# Altium project Almazny.PrjPCB (part 1 of 2)
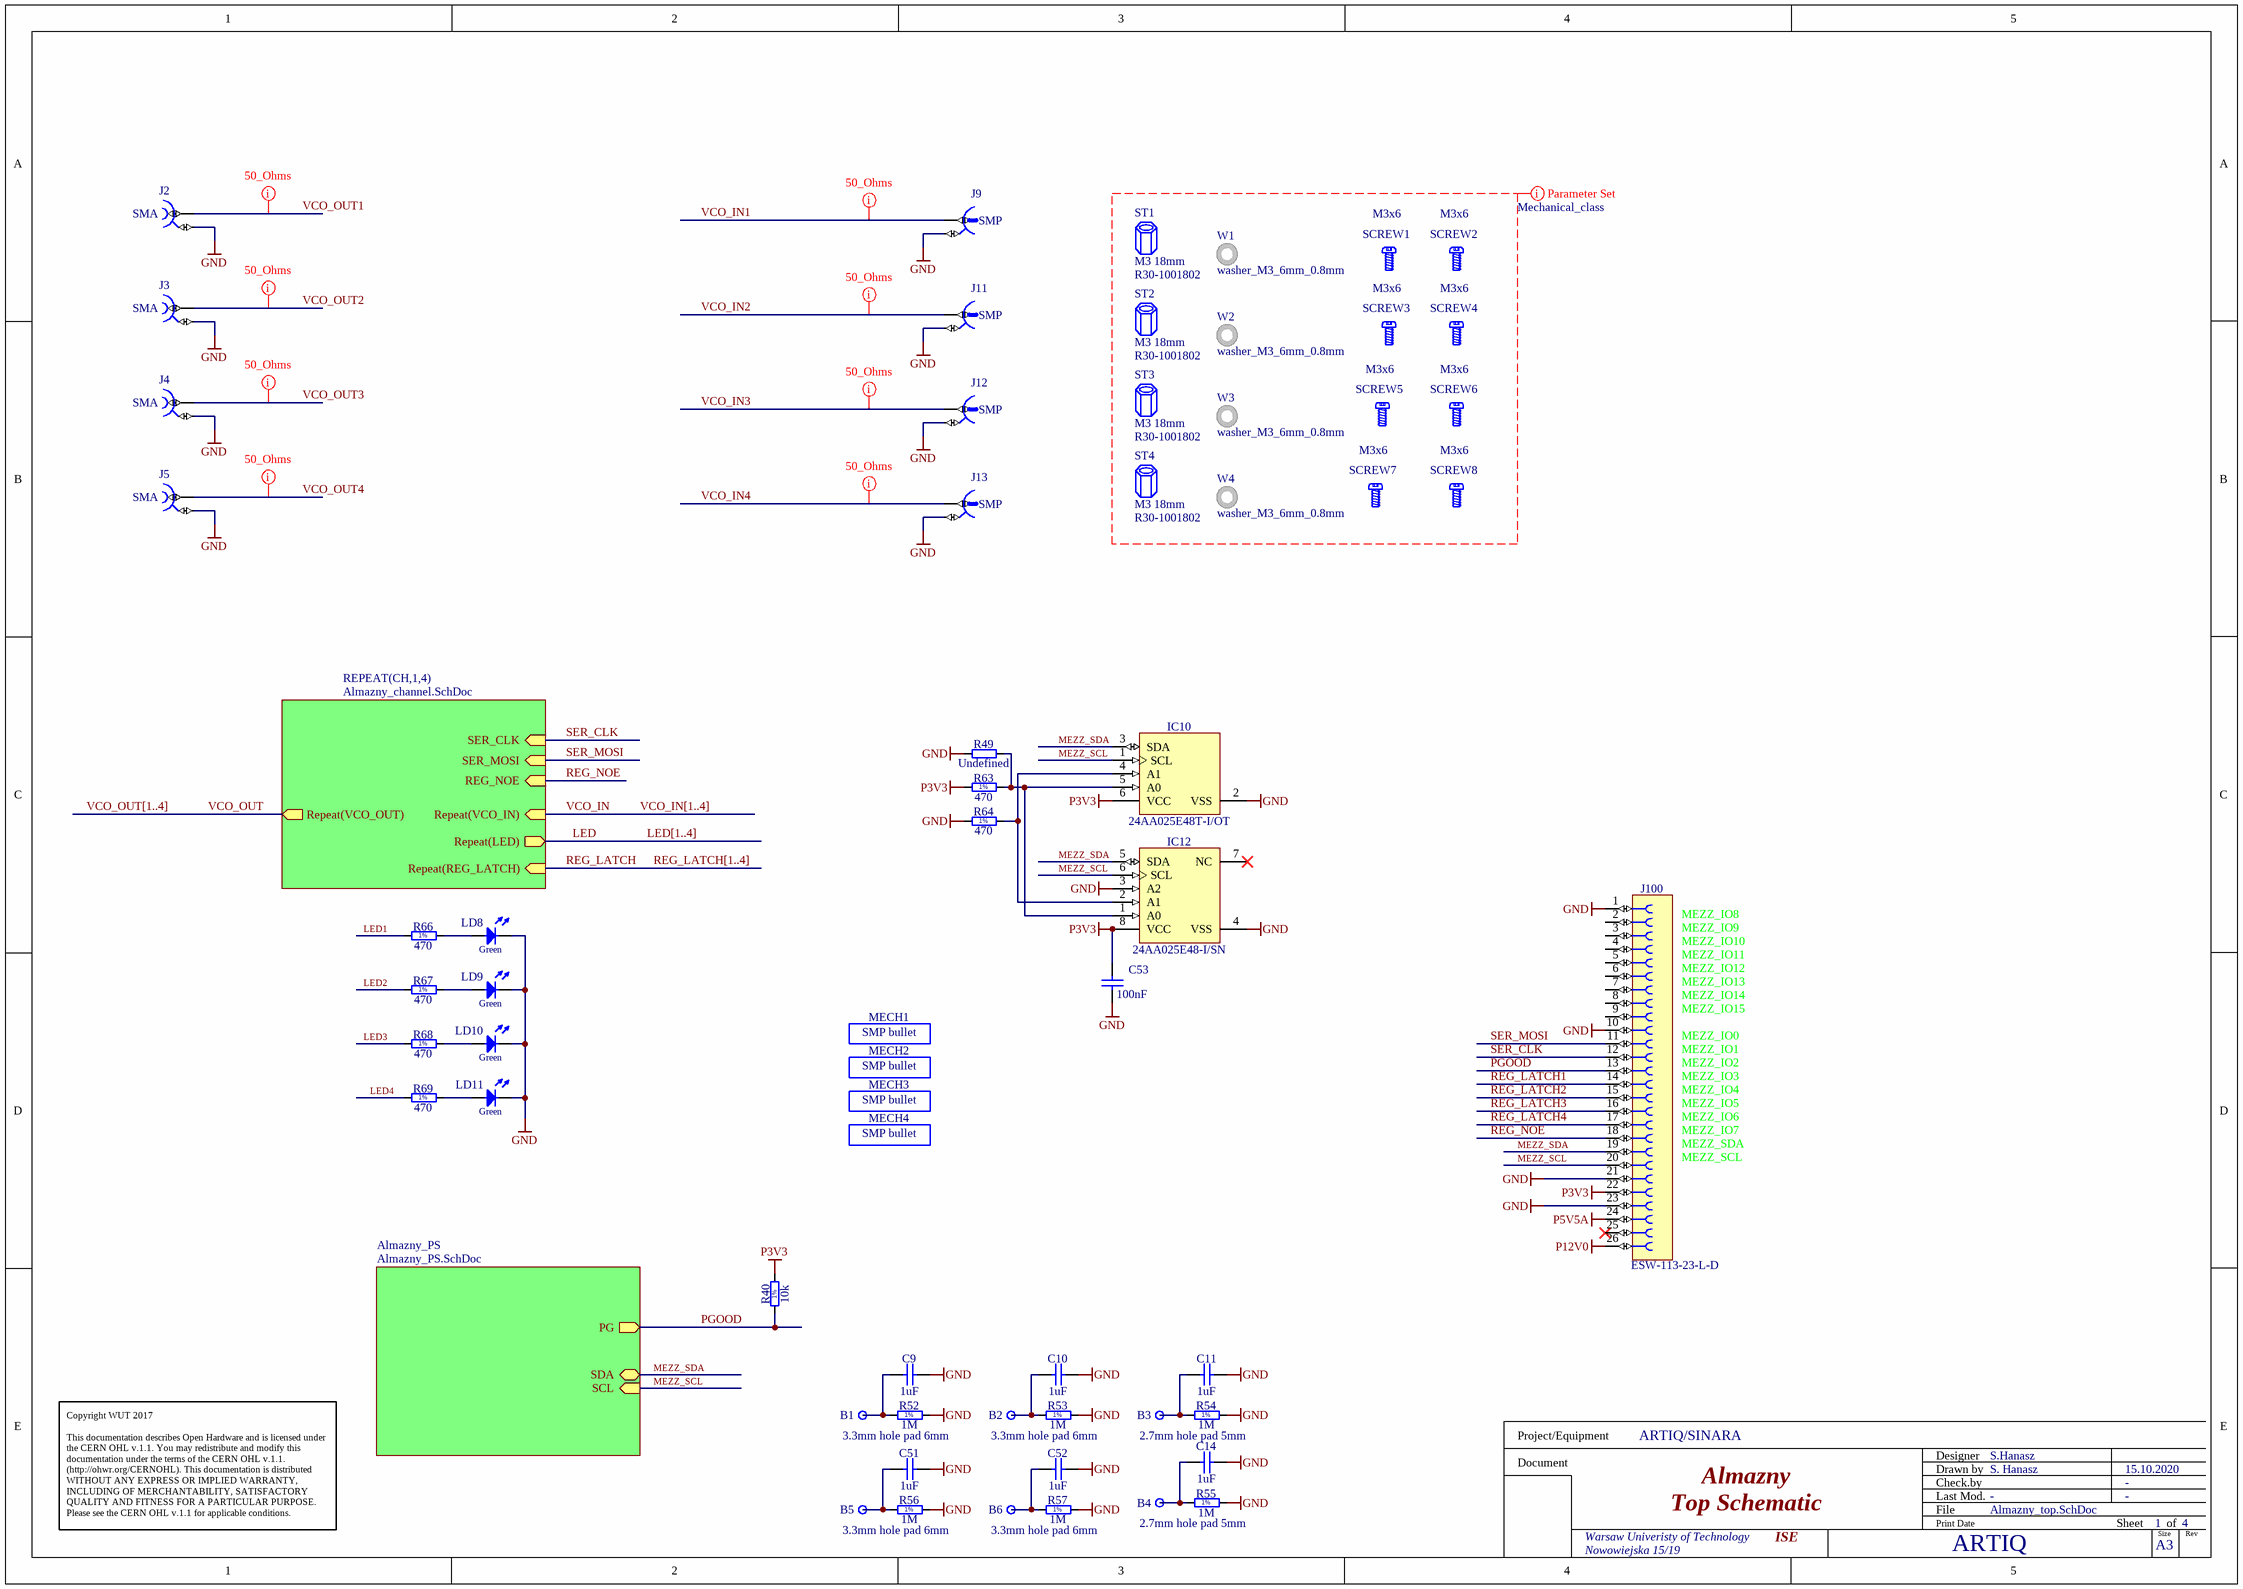
[diagram p0: Almazny_top.SchDoc]
P_version: 1.3.1
4 sheets, 429 parts. Net scope: hierarchical (ports join the sheet entries above them; power ports are global).
Board file: Almazny.PcbDoc
Sheets:
  Almazny_top.SchDoc
    CH1 = Almazny_channel.SchDoc
    CH2 = Almazny_channel.SchDoc
    CH3 = Almazny_channel.SchDoc
    CH4 = Almazny_channel.SchDoc
    Almazny_PS = Almazny_PS.SchDoc
      LT3094_N2V25 = LT3094.SchDoc
      LT3094_N5V0 = LT3094.SchDoc

## Sheet Almazny_top.SchDoc: Almazny
size 420 x 297 mm; Author: many authors; CompanyName: WUT; DrawnBy: S. Hanasz; Organization: WUT ISE; Address1: Warsaw Univeristy of Technology; Address2: Nowowiejska 15/19; Revision: 1.3.1; SheetNumber: 1; SheetTotal: 4; EDA_Number: ARTIQ; Projet: ARTIQ/SINARA; ModifiedBy: -; CreateDate: 15.10.2020; CheckedDate: -; Title2: Top Schematic; DivGrp: ISE; Designer: S.Hanasz; ModifiedDate: -; ProjectName: ARTIQ/SINARA

### Parts
B1  3.3mm hole pad 6mm  [MTG330_600]
B2  3.3mm hole pad 6mm  [MTG330_600]
B3  2.7mm hole pad 5mm  [MTG270_500]
B4  2.7mm hole pad 5mm  [MTG270_500]
B5  3.3mm hole pad 6mm  [MTG330_600]
B6  3.3mm hole pad 6mm  [MTG330_600]
C9  1uF  [CAPC3216X140N]
C10  1uF  [CAPC3216X140N]
C11  1uF  [CAPC3216X140N]
C14  1uF  [CAPC3216X140N]
C51  1uF  [CAPC3216X140N]
C52  1uF  [CAPC3216X140N]
C53  100nF  [CAPC1005X55N]
IC10  24AA025E48T-I/OT  [SOT95P280X145-6N]
IC12  24AA025E48-I/SN  [SOIC127P600X175-8N]
J2  SMA  [TELEGARTNER_J01151A0451]
J3  SMA  [TELEGARTNER_J01151A0451]
J4  SMA  [TELEGARTNER_J01151A0451]
J5  SMA  [TELEGARTNER_J01151A0451]
J9  SMP  [MOLEX_85305-0232]
J11  SMP  [MOLEX_85305-0232]
J12  SMP  [MOLEX_85305-0232]
J13  SMP  [MOLEX_85305-0232]
J100  ESW-113-23-L-D  [ESW-113-23-L-D]
LD8  Green  [LED_DIALIGHT_555-230]
LD9  Green  [LED_DIALIGHT_555-230]
LD10  Green  [LED_DIALIGHT_555-230]
LD11  Green  [LED_DIALIGHT_555-230]
MECH1  SMP bullet  [GENERIC_MECH]
MECH2  SMP bullet  [GENERIC_MECH]
MECH3  SMP bullet  [GENERIC_MECH]
MECH4  SMP bullet  [GENERIC_MECH]
R40  10k  [RESC1005X40N]
R49  Undefined  [RESC1005X40N]
R52  1M  [RESC1608X55N]
R53  1M  [RESC1608X55N]
R54  1M  [RESC1608X55N]
R55  1M  [RESC1608X55N]
R56  1M  [RESC1608X55N]
R57  1M  [RESC1608X55N]
R63  470  [RESC1005X40N]
R64  470  [RESC1005X40N]
R66  470  [RESC1005X40N]
R67  470  [RESC1005X40N]
R68  470  [RESC1005X40N]
R69  470  [RESC1005X40N]
SCREW1  M3x6  [BOSSARD_BN9524-3271397_v]
SCREW2  M3x6  [BOSSARD_BN9524-3271397_v]
SCREW3  M3x6  [BOSSARD_BN9524-3271397_v]
SCREW4  M3x6  [BOSSARD_BN9524-3271397_v]
SCREW5  M3x6  [BOSSARD_BN9524-3271397_v]
SCREW6  M3x6  [BOSSARD_BN9524-3271397_v]
SCREW7  M3x6  [BOSSARD_BN9524-3271397_v]
SCREW8  M3x6  [BOSSARD_BN9524-3271397_v]
ST1  M3 18mm  [R30-1001802]
ST2  M3 18mm  [R30-1001802]
ST3  M3 18mm  [R30-1001802]
ST4  M3 18mm  [R30-1001802]
W1  washer_M3_6mm_0.8mm  [washer_M3_6mm_0.8mm]
W2  washer_M3_6mm_0.8mm  [washer_M3_6mm_0.8mm]
W3  washer_M3_6mm_0.8mm  [washer_M3_6mm_0.8mm]
W4  washer_M3_6mm_0.8mm  [washer_M3_6mm_0.8mm]

### Sub-sheets
Almazny_PS = Almazny_PS.SchDoc: PG (out), SDA (bidir), SCL (in)
REPEAT(CH,1,4) = Almazny_channel.SchDoc: SER_CLK (in), SER_MOSI (in), REG_NOE (in), Repeat(VCO_OUT) (out), Repeat(VCO_IN) (in), Repeat(REG_LATCH) (in), Repeat(LED) (out)

### Nets
GND: C9.2 C10.2 C11.2 C14.2 C51.2 C52.2 C53.1 IC10.2(VSS) IC12.3(A2) IC12.4(VSS) J2.2 J3.2 J4.2 J5.2 J9.2 J11.2 J12.2 J13.2 J100.1 J100.10 J100.21 J100.23 LD8.1(C) LD9.1(C) LD10.1(C) LD11.1(C) R49.1 R52.2 R53.2 R54.2 R55.2 R56.2 R57.2 R64.1
P3V3: C53.2 IC10.6(VCC) IC12.8(VCC) J100.22 R40.2 R63.1
P5V5A: J100.24
P12V0: J100.26
LED: sheet REPEAT(CH,1,4)/Repeat(LED)
LED1: R66.1
LED2: R67.1
LED3: R68.1
LED4: R69.1
MEZZ_SCL: IC10.1(SCL) IC12.6(SCL) J100.20 ; sheet Almazny_PS/SCL
MEZZ_SDA: IC10.3(SDA) IC12.5(SDA) J100.19 ; sheet Almazny_PS/SDA
PGOOD: J100.13 R40.1 ; sheet Almazny_PS/PG
REG_LATCH: sheet REPEAT(CH,1,4)/Repeat(REG_LATCH)
REG_LATCH1: J100.14
REG_LATCH2: J100.15
REG_LATCH3: J100.16
REG_LATCH4: J100.17
REG_NOE: J100.18 ; sheet REPEAT(CH,1,4)/REG_NOE
SER_CLK: J100.12 ; sheet REPEAT(CH,1,4)/SER_CLK
SER_MOSI: J100.11 ; sheet REPEAT(CH,1,4)/SER_MOSI
VCO_IN: sheet REPEAT(CH,1,4)/Repeat(VCO_IN)
VCO_IN1: J9.1
VCO_IN2: J11.1
VCO_IN3: J12.1
VCO_IN4: J13.1
VCO_OUT: sheet REPEAT(CH,1,4)/Repeat(VCO_OUT)
VCO_OUT1: J2.1
VCO_OUT2: J3.1
VCO_OUT3: J4.1
VCO_OUT4: J5.1
NetB1_1: B1.1 C9.1 R52.1
NetB2_1: B2.1 C10.1 R53.1
NetB3_1: B3.1 C11.1 R54.1
NetB4_1: B4.1 C14.1 R55.1
NetB5_1: B5.1 C51.1 R56.1
NetB6_1: B6.1 C52.1 R57.1
NetIC10_4: IC10.4(A1) IC12.2(A1) R64.2
NetIC10_5: IC10.5(A0) IC12.1(A0) R49.2 R63.2
NetLD8_2: LD8.2(A) R66.2
NetLD9_2: LD9.2(A) R67.2
NetLD10_2: LD10.2(A) R68.2
NetLD11_2: LD11.2(A) R69.2

Not connected (* = marked no-connect by the designer): IC12 7(NC)*; J100 2 3 4 5 6 7 8 9 25*

### Buses and harness runs
bus LED[1..4]
bus REG_LATCH[1..4]
bus VCO_IN[1..4]
bus VCO_OUT[1..4]

### Layout directives
net class 50_Ohms: VCO_IN1, VCO_IN2, VCO_IN3, VCO_IN4, VCO_OUT1, VCO_OUT2, VCO_OUT3, VCO_OUT4
CompClassName: Mechanical_class: (no net found under the mark)

### Notes on the sheet
- (near J100) MEZZ_IO8
- (near J100) MEZZ_IO9
- (near J100) MEZZ_IO10
- (near J100) MEZZ_IO11
- (near J100) MEZZ_IO12
- (near J100) MEZZ_IO13
- (near J100) MEZZ_IO14
- (near J100) MEZZ_IO15
- (near J100) MEZZ_IO0
- (near J100) MEZZ_IO1
- (near J100) MEZZ_IO2
- (near J100) MEZZ_IO3
- (near J100) MEZZ_IO4
- (near J100) MEZZ_IO5
- (near J100) MEZZ_IO6
- (near J100) MEZZ_IO7
- (near J100) MEZZ_SDA
- (near J100) MEZZ_SCL
- Copyright WUT 2017
  This documentation describes Open Hardware and is licensed under the CERN OHL v.1.1. You may redistribute and modify this documentation under the terms of the CERN OHL v.1.1. (http://ohwr.org/CERNOHL). This documentation is distributed WITHOUT ANY EXPRESS OR IMPLIED WARRANTY, INCLUDING OF MERCHANTABILITY, SATISFACTORY QUALITY AND FITNESS FOR A PARTICULAR PURPOSE. Please see the CERN OHL v.1.1 for applicable conditions.
- Project/Equipment
- Document
- Designer
- Drawn by
- Check.by
- File
- Last Mod.
- Print Date
- Sheet
- Size
- A3
- of
- Rev
- (in symbol R0402_10K_1%_0.0625W_100PPM) 1%
- (in symbol R0402_470R_1%_0.0625W_100PPM) 1%
- (in symbol R0603_1M_1%_0.1W_100PPM) 1%

### Library data of the parts
B1 B2 B5 B6 = Hole_3_3mm: Part Number: PLATED_HOLE3.3_PAD560; Part Description: Plated Through Hole: Hole Dia.=2.7mm Pad Dia.=5.0mm; Mounted: No; Component Kind: Standard (No BOM); Component Type: Standard (No BOM); Pin Count: 1; Family: Plated Hole; Socket: No; SMD: No; Sense: No; Status: None; ComponentHeight: 0mm; HelpURL: Undefined; Author: CERN DEM JMW; CreateDate: 27/09/2011; LatestRevisionDate: 27/09/2011; PackageDescription: Plated Through Hole: Hole Dia.=2.7mm Pad Dia.=5.0mm
B3 B4 = Hole_2_7mm: Part Number: PLATED_HOLE2.7_PAD5.0; Part Description: Plated Through Hole: Hole Dia.=2.7mm Pad Dia.=5.0mm; Mounted: No; Component Kind: Standard (No BOM); Component Type: Standard (No BOM); Pin Count: 1; Family: Plated Hole; Socket: No; SMD: No; Sense: No; Status: None; ComponentHeight: 0mm; HelpURL: Undefined; Author: CERN DEM JMW; CreateDate: 27/09/2011; LatestRevisionDate: 27/09/2011; PackageDescription: Plated Through Hole: Hole Dia.=2.7mm Pad Dia.=5.0mm
C9-C11 C14 C51 C52 = CC1206_1UF_50V_10%_X7R: Non-polarised capacitor; Part Description: SMD Multilayer Chip Ceramic Capacitor; Manufacturer: GENERIC; Manufacturer1 Part Number: C1206F105K5RACTU; Voltage: 50V; TC: X7R; Tolerance: ±10%; Part Number: CC1206_1UF_50V_10%_X7R; Component Kind: Standard; Component Type: Standard; Pin Count: 2; Value: 1uF; Status: Preferred; Manufacturer Part Number: CC1206_1UF_50V_10%_X7R; Case: 1206; Mounted: Yes; Socket: No; SMD: Yes; Sense: No; Manufacturer1 Example: KEMET; Manufacturer1 ComponentHeight: 1.8mm; HelpURL: \\cern.ch\dfs\Applications\Altium\Datasheets\CC1206_X7R_KEMET_OPENMODE.pdf; Author: CERN DEM JLC; CreateDate: 07.11.2012; LatestRevisionDate: 07.11.2012
C53 = CC0402_100NF_16V_10%_X5R: Non-polarised capacitor; Part Description: SMD Multilayer Chip Ceramic Capacitor; Manufacturer: GENERIC; Manufacturer1 Part Number: GRM155R61C104KA88D; Voltage: 16V; TC: X5R; Tolerance: ±10%; Part Number: CC0402_100NF_16V_10%_X5R; Component Kind: Standard; Component Type: Standard; Pin Count: 2; Value: 100nF; Status: None; Manufacturer Part Number: CC0402_100NF_16V_10%_X5R; Case: 0402; Mounted: Yes; Socket: No; SMD: Yes; Sense: No; Manufacturer1 Example: MURATA; Manufacturer1 ComponentHeight: 0.55mm; HelpURL: \\cern.ch\dfs\Applications\Altium\Datasheets\CC0402_X5R_MURATA_GRM.pdf; Author: CERN DEM JLC; CreateDate: 10.12.2013; LatestRevisionDate: 10.12.2013
IC10 = 24AA025E48T-I/OT: 1.7V-5.5V, 2K I2C Serial EEPROM With EUI-48 Node Identity; Part Description: 1.7V-5.5V, 2K I2C Serial EEPROM with EUI-48™ Node Identity; Cascadable; Manufacturer: MICROCHIP TECHNOLOGY; PressFit: No; Bonding: No; Part Number: 24AA025E48T-I/OT; Component Kind: Standard; Component Type: Standard; Device: 24AA025E48T-I/OT; PackageDescription: SOT, 0.95mm pitch; 6 pin, 1.60mm W X 2.90mm L X 1.45mm H body, IPC Medium Density; Manufacturer Part Number: 24AA025E48T-I/OT; Pin Count: 6; Case: SOT23-6; Mounted: Yes; Socket: No; SMD: Yes; Sense: No; ComponentHeight: 1.45mm; HelpURL: \\cern.ch\dfs\Applications\Altium\Datasheets\24AA025E48T-I-OT.pdf; Author: CERN DEM BC; CreateDate: 06.12.2019; LatestRevisionDate: 06.12.2019
IC12 = 24AA025E48-I/SN: 1.7V-5.5V, 2K I2C™ Serial EEPROMs with EUI-48™ Node Identity; Manufacturer: MICROCHIP TECHNOLOGY; PressFit: No; Bonding: No; Part Number: 24AA025E48-I/SN; Component Kind: Standard; Component Type: Standard; Device: 24AA025E48-I/SN; PackageDescription: SOIC, 1.27mm Pitch; 8 Pin - Body 4x5mm, IPC Medium Density; Part Description: 1.7V-5.5V, 2K I2C™ Serial EEPROMs with EUI-48™ Node Identity; Manufacturer Part Number: 24AA025E48-I/SN; Pin Count: 8; Case: SOIC8; Mounted: Yes; Socket: No; SMD: Yes; Sense: No; ComponentHeight: 1.75mm; HelpURL: \\cern.ch\dfs\Applications\Altium\Datasheets\24AA025E48-I-SN.pdf; Author: CERN DEM MR; CreateDate: 19.07.2016; LatestRevisionDate: 19.07.2016
J2-J5 = TELEGARTNER_J01151A0451: Part Description: SMA 50 ohms Edge Mount Bulkhead Jack Receptacle; PressFit: No; Part Number: TELEGARTNER_J01151A0451; Component Kind: Standard; Component Type: Standard; Pin Count: 2; Family: SMA; Mounted: Yes; Socket: No; SMD: No; Sense: No; Status: None; Manufacturer: TELEGARTNER; Manufacturer Part Number: J01151A0451; ComponentHeight: 7mm; HelpURL: \\cern.ch\dfs\Applications\Altium\Datasheets\TELEGARTNER_J01151A0451.pdf; Author: CERN DEM JLC; CreateDate: 27.10.2016; LatestRevisionDate: 27.10.2016
J9 J11-J13 = MOLEX_85305-0232: Part Description: 50 Ohms, SMP Surface Mount Plug, Limited Detent; Manufacturer: MOLEX; PressFit: No; Part Number: MOLEX_85305-0232; Component Kind: Standard; Component Type: Standard; Pin Count: 2; Family: SMP; Mounted: Yes; Socket: No; SMD: Yes; Sense: No; Status: None; Manufacturer Part Number: 85305-0232; ComponentHeight: 4.1mm; HelpURL: \\cern.ch\dfs\Applications\Altium\Datasheets\MOLEX_85305-0232.pdf; Author: CERN DEM JMW; CreateDate: 09.08.2016; LatestRevisionDate: 09.08.2016
J100 = ESW-113-23-L-D: Connector Elevated Socket 26 POS 2.54mm, 13.59mm height; Manufacturer: Samtec; Manufacturer Part Number: ESW-113-23-L-D
LD8-LD11 = LED_DIALIGHT_555-2301F: LED Green 1C 2A; Part Description: Single 2mm Green LED CBI® Circuit Board Indicator; PressFit: No; Bonding: No; Part Number: LED_DIALIGHT_555-2301F; Component Kind: Standard; Component Type: Standard; Color: Green; PackageDescription: Single 2mm Green LED, Body 5.08x2.54mm, Pin spacing 2.54mm; Manufacturer: DIALIGHT; Manufacturer Part Number: 555-2301F; Pin Count: 2; Mounted: Yes; Socket: No; SMD: No; Sense: No; ComponentHeight: 6.35mm; HelpURL: \\cern.ch\dfs\Applications\Altium\Datasheets\LED_DIALIGHT_555-2301F.pdf; Author: CERN DEM JMW; CreateDate: 22.09.2008; LatestRevisionDate: 17.03.2010
MECH1-MECH4 = Generic_mechanical: generic; Part Number: SMP-FS2A-1674; Manufacturer: AMPHENOL RF; PressFit: No; Component Kind: Accessories; Component Type: Standard; Footprint: generic_MECH; Pin Count: 0; PackageDescription: generic; Mounted: Yes; Socket: No; SMD: No; Sense: No; Status: None; Value: SMP bullet; Part Description: SMP bullet; Manufacturer Part Number: SMP-FS2A-1674; ComponentHeight: 19mm; Author: GK; CreateDate: 28.10.2019; LatestRevisionDate: 28.10.2019
R40 = R0402_10K_1%_0.0625W_100PPM: Resistor - 1%; Part Description: General Purpose Thick Film Chip Resistor; Manufacturer: GENERIC; Manufacturer1 Part Number: 232270671003L; TC: ±100ppm/°C; PressFit: No; Part Number: R0402_10K_1%_0.0625W_100PPM; Component Kind: Standard; Component Type: Standard; Pin Count: 2; Value: 10k; Status: Not Recommended; Power: 0.0625W; Tolerance: ±1%; Manufacturer Part Number: R0402_10K_1%_0.0625W_100PPM; Case: 0402; Mounted: Yes; Sense: No; Socket: No; SMD: Yes; Manufacturer1 Example: YAGEO PHYCOMP; Manufacturer1 ComponentHeight: 0.4mm; HelpURL: \\cern.ch\dfs\Applications\Altium\Datasheets\R0402_Phycomp_RC0402.pdf; Author: CERN DEM JLC; CreateDate: 03.12.2007; LatestRevisionDate: 17.10.2012
R49 = R0402_NO-VALUE: Resistor; Part Description: Reserved Footprint For a 0402 (1005) Chip Resistor; PressFit: No; Mounted: No; Part Number: R0402_NO-VALUE; Component Kind: Standard; Component Type: Standard; Pin Count: 2; Value: Undefined; Status: None; Manufacturer: Undefined; Manufacturer Part Number: R0402_NO-VALUE; Case: 0402; Sense: No; Socket: No; SMD: Yes; Manufacturer1 Example: Undefined; Manufacturer1 Part Number: Undefined; Manufacturer1 ComponentHeight: Undefined; HelpURL: Undefined; Author: CERN DEM JLC; CreateDate: 03.12.2007; LatestRevisionDate: 13.03.2008
R52-R57 = R0603_1M_1%_0.1W_100PPM: Resistor - 1%; Part Description: General Purpose Thick Film Chip Resistor; Manufacturer: GENERIC; Manufacturer1 Part Number: NRC06F1004TRF; Power: 0.1W; TC: ±100ppm/°C; PressFit: No; Part Number: R0603_1M_1%_0.1W_100PPM; Component Kind: Standard; Component Type: Standard; Pin Count: 2; Value: 1M; Status: Preferred; Tolerance: ±1%; Manufacturer Part Number: R0603_1M_1%_0.1W_100PPM; Case: 0603; Mounted: Yes; Sense: No; Socket: No; SMD: Yes; Manufacturer1 Example: NIC COMPONENT; Manufacturer1 ComponentHeight: 0.55mm; HelpURL: \\cern.ch\dfs\Applications\Altium\Datasheets\R0603_NIC_NRC.pdf; Author: CERN DEM JLC; CreateDate: 03.12.2007; LatestRevisionDate: 13.03.2008
R63 R64 R66-R69 = R0402_470R_1%_0.0625W_100PPM: Resistor - 1%; Part Description: General Purpose Thick Film Chip Resistor; Manufacturer: GENERIC; Manufacturer1 Part Number: 232270674701L; TC: ±100ppm/°C; PressFit: No; Part Number: R0402_470R_1%_0.0625W_100PPM; Component Kind: Standard; Component Type: Standard; Pin Count: 2; Value: 470; Status: Not Recommended; Power: 0.0625W; Tolerance: ±1%; Manufacturer Part Number: R0402_470R_1%_0.0625W_100PPM; Case: 0402; Mounted: Yes; Sense: No; Socket: No; SMD: Yes; Manufacturer1 Example: YAGEO PHYCOMP; Manufacturer1 ComponentHeight: 0.4mm; HelpURL: \\cern.ch\dfs\Applications\Altium\Datasheets\R0402_Phycomp_RC0402.pdf; Author: CERN DEM JLC; CreateDate: 03.12.2007; LatestRevisionDate: 17.10.2012
SCREW1-SCREW8 = BOSSARD_BN9524-3271397_v: Screw; Part Description: M3 L=6mm Hexalobular Socket Flat Head Screw Fully Threaded with Special Low Head, ~08.8, Zinc Plated Blue; Manufacturer Part Number: BN9524 Art.3271397; PressFit: No; Part Number: BOSSARD_BN9524-3271397_v; Component Kind: Standard; Component Type: Mechanical; Pin Count: 0; PackageDescription: M3 L=6mm Hexalobular Socket Flat Head Screw Fully Threaded with Special Low Head, ~08.8, Zinc Plated Blue; Mounted: Yes; Socket: No; SMD: No; Sense: No; Status: None; Value: M3x6; Manufacturer: BOSSARD; ComponentHeight: 1.37mm; HelpURL: \\cern.ch\dfs\Applications\Altium\Datasheets\BOSSARD_BN9524-3271397.pdf; Author: CERN DEM JLC; CreateDate: 11.03.2019; LatestRevisionDate: 11.03.2019
ST1-ST4 = STANDOFF_HARWIN_R30_1001802: M3.0x18 standoff; Manufacturer: Harwin; Manufacturer Part Number: R30-1001802
W1-W4 = washer_M3_6mm_0.8mm: M3 Washer: / ID: 3.2mm / OD: 6mm / Thickness 0.8mm; Manufacturer: Accu Limited; Manufacturer Part Number: HAFZ-M3-A4

## Sheet Almazny_channel.SchDoc: Almazny
size 420 x 297 mm; CompanyName: WUT; DrawnBy: S.Hanasz; Organization: WUT ISE; Address1: Warsaw Univeristy of Technology; Address2: Nowowiejska 15/19; Revision: 1.3.1; SheetNumber: 3; SheetTotal: 4; EDA_Number: ARTIQ; Projet: ARTIQ/SINARA; ModifiedBy: -; CreateDate: 15.10.2020; CheckedDate: -; Title2: Signal Channel; DivGrp: ISE; Designer: S.Hanasz; ModifiedDate: -; ProjectName: ARTIQ/SINARA
Used 4 times, as channels CH1, CH2, CH3, CH4. Parts and nets are listed once, with the designators drawn on the sheet.
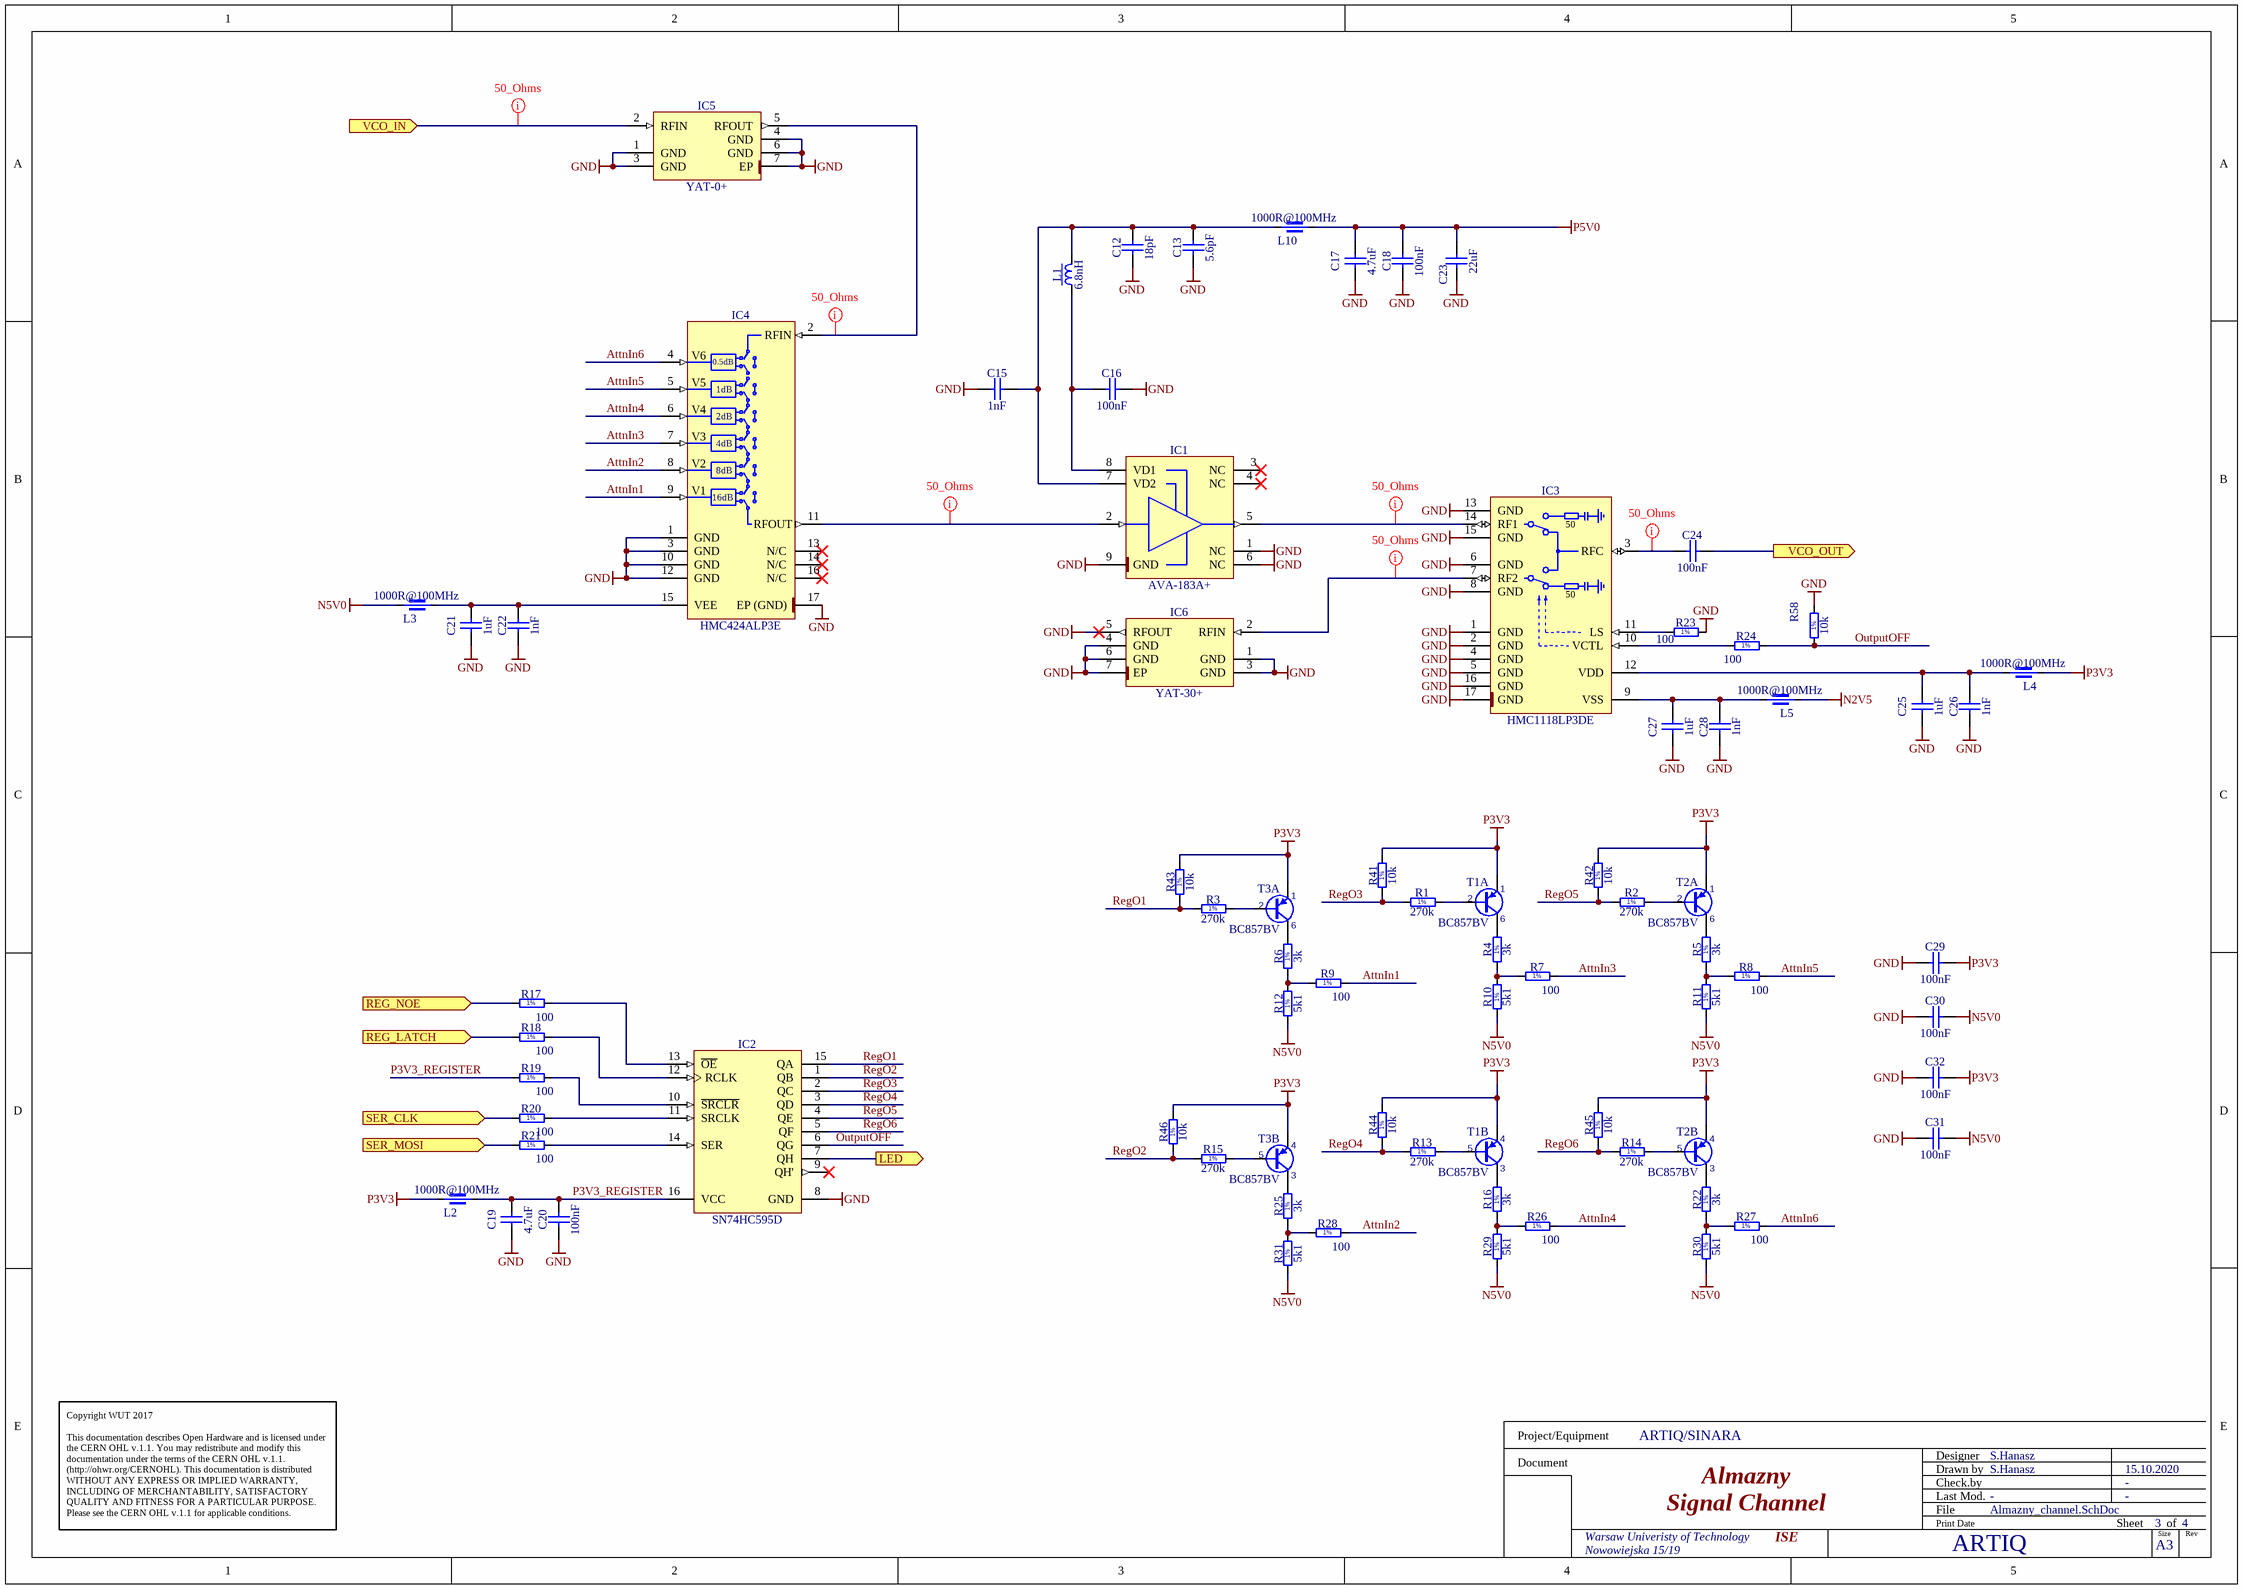
[diagram p1: Almazny_channel.SchDoc]

### Parts
C12  18pF  [CAPC1005X55N]
C13  5.6pF  [CAPC1005X61N]
C15  1nF  [CAPC1005X55N]
C16  100nF  [CAPC1005X55N]
C17  4.7uF  [CAPC1709X95N]
C18  100nF  [CAPC1005X55N]
C19  4.7uF  [CAPC1709X95N]
C20  100nF  [CAPC1005X55N]
C21  1uF  [CAPC1608X87N]
C22  1nF  [CAPC1005X55N]
C23  22uF  [CAPC2012X135N]
C24  100nF  [CAPC1005X70N]
C25  1uF  [CAPC1608X87N]
C26  1nF  [CAPC1005X55N]
C27  1uF  [CAPC1608X87N]
C28  1nF  [CAPC1005X55N]
C29  100nF  [CAPC1005X55N]
C30  100nF  [CAPC1005X55N]
C31  100nF  [CAPC1005X55N]
C32  100nF  [CAPC1005X55N]
IC1  AVA-183A+  [MINI-CIRCUITS_DQ849]
IC2  SN74HC595D  [SOIC127P600X175-16N]
IC3  HMC1118LP3DE  [QFN50P300X300X95-17N-S190]
IC4  HMC424ALP3E  [QFN50P300X300X100-17N-S195]
IC5  YAT-0+  [MINI-CIRCUITS_MC1630]
IC6  YAT-30+  [MINI-CIRCUITS_MC1630]
L1  6.8nH  [INDC2014X145N]
L2  1000R@100MHz  [INDC1608X95N]
L3  1000R@100MHz  [INDC1608X95N]
L4  1000R@100MHz  [INDC1608X95N]
L5  1000R@100MHz  [INDC1608X95N]
L10  1000R@100MHz  [INDC1608X95N]
R1  270k  [RESC1005X40N]
R2  270k  [RESC1005X40N]
R3  270k  [RESC1005X40N]
R4  3k  [RESC1005X40N]
R5  3k  [RESC1005X40N]
R6  3k  [RESC1005X40N]
R7  100  [RESC1005X40N]
R8  100  [RESC1005X40N]
R9  100  [RESC1005X40N]
R10  5k1  [RESC1005X40N]
R11  5k1  [RESC1005X40N]
R12  5k1  [RESC1005X40N]
R13  270k  [RESC1005X40N]
R14  270k  [RESC1005X40N]
R15  270k  [RESC1005X40N]
R16  3k  [RESC1005X40N]
R17  100  [RESC1005X40N]
R18  100  [RESC1005X40N]
R19  100  [RESC1005X40N]
R20  100  [RESC1005X40N]
R21  100  [RESC1005X40N]
R22  3k  [RESC1005X40N]
R23  100  [RESC1005X40N]
R24  100  [RESC1005X40N]
R25  3k  [RESC1005X40N]
R26  100  [RESC1005X40N]
R27  100  [RESC1005X40N]
R28  100  [RESC1005X40N]
R29  5k1  [RESC1005X40N]
R30  5k1  [RESC1005X40N]
R31  5k1  [RESC1005X40N]
R41  10k  [RESC1005X40N]
R42  10k  [RESC1005X40N]
R43  10k  [RESC1005X40N]
R44  10k  [RESC1005X40N]
R45  10k  [RESC1005X40N]
R46  10k  [RESC1005X40N]
R58  10k  [RESC1005X40N]
T1  BC857BV  [SOTFL50P160X60-6N]  (parts A,B of 2)
T2  BC857BV  [SOTFL50P160X60-6N]  (parts A,B of 2)
T3  BC857BV  [SOTFL50P160X60-6N]  (parts A,B of 2)

### Ports
LED (out), REG_LATCH (in), REG_NOE (in), SER_CLK (in), SER_MOSI (in), VCO_IN (in), VCO_OUT (out)

### Nets
GND: C12.1 C13.1 C15.1 C16.2 C17.1 C18.1 C19.1 C20.1 C21.1 C22.1 C23.1 C25.1 C26.1 C27.1 C28.1 C29.1 C30.1 C31.1 C32.1 IC1.1(NC) IC1.6(NC) IC1.9(GND) IC2.8(GND) IC3.1(GND) IC3.2(GND) IC3.4(GND) IC3.5(GND) IC3.6(GND) IC3.8(GND) IC3.13(GND) IC3.15(GND) IC3.16(GND) IC3.17(GND) IC4.1(GND) IC4.3(GND) IC4.10(GND) IC4.12(GND) IC4.17(EP_(GND)) IC5.1(GND) IC5.3(GND) IC5.4(GND) IC5.6(GND) IC5.7(EP) IC6.1(GND) IC6.3(GND) IC6.4(GND) IC6.5(RFOUT) IC6.6(GND) IC6.7(EP) R23.1 R58.2
N2V5: L5.1
N5V0: C30.2 C31.2 L3.1 R10.1 R11.1 R12.1 R29.1 R30.1 R31.1
P3V3: C29.2 C32.2 L2.1 L4.1 R41.2 R42.2 R43.2 R44.2 R45.2 R46.2 T1.1(E) T1.4(E) T2.1(E) T2.4(E) T3.1(E) T3.4(E)
P5V0: C17.2 C18.2 C23.2 L10.2
AttnIn1: IC4.9(V1) R9.2
AttnIn2: IC4.8(V2) R28.2
AttnIn3: IC4.7(V3) R7.2
AttnIn4: IC4.6(V4) R26.2
AttnIn5: IC4.5(V5) R8.2
AttnIn6: IC4.4(V6) R27.2
LED: IC2.7(QH) ; port LED
OutputOFF: IC2.6(QG) R24.1 R58.1
P3V3_REGISTER: C19.2 C20.2 IC2.16(VCC) L2.2 R19.1
REG_LATCH: R18.1 ; port REG_LATCH
REG_NOE: R17.1 ; port REG_NOE
RegO1: IC2.15(QA) R3.1 R43.1
RegO2: IC2.1(QB) R15.1 R46.1
RegO3: IC2.2(QC) R1.1 R41.1
RegO4: IC2.3(QD) R13.1 R44.1
RegO5: IC2.4(QE) R2.1 R42.1
RegO6: IC2.5(QF) R14.1 R45.1
SER_CLK: R20.1 ; port SER_CLK
SER_MOSI: R21.1 ; port SER_MOSI
VCO_IN: IC5.2(RFIN) ; port VCO_IN
VCO_OUT: C24.2 ; port VCO_OUT
NetC12_2: C12.2 C13.2 C15.2 IC1.7(VD2) L1.2 L10.1
NetC16_1: C16.1 IC1.8(VD1) L1.1
NetC21_2: C21.2 C22.2 IC4.15(VEE) L3.2
NetC24_1: C24.1 IC3.3(RFC)
NetC25_2: C25.2 C26.2 IC3.12(VDD) L4.2
NetC27_2: C27.2 C28.2 IC3.9(VSS) L5.2
NetIC1_2: IC1.2(RF_IN) IC4.11(RFOUT)
NetIC1_5: IC1.5(RF_OUT) IC3.14(RF1)
NetIC2_10: IC2.10(~{SRCLR}) R19.2
NetIC2_11: IC2.11(SRCLK) R20.2
NetIC2_12: IC2.12(RCLK) R18.2
NetIC2_13: IC2.13(~{OE}) R17.2
NetIC2_14: IC2.14(SER) R21.2
NetIC3_7: IC3.7(RF2) IC6.2(RFIN)
NetIC3_10: IC3.10(VCTL) R24.2
NetIC3_11: IC3.11(LS) R23.2
NetIC4_2: IC4.2(RFIN) IC5.5(RFOUT)
NetR1_2: R1.2 T1.2(B)
NetR2_2: R2.2 T2.2(B)
NetR3_2: R3.2 T3.2(B)
NetR4_1: R4.1 R7.1 R10.2
NetR4_2: R4.2 T1.6(C)
NetR5_1: R5.1 R8.1 R11.2
NetR5_2: R5.2 T2.6(C)
NetR6_1: R6.1 R9.1 R12.2
NetR6_2: R6.2 T3.6(C)
NetR13_2: R13.2 T1.5(B)
NetR14_2: R14.2 T2.5(B)
NetR15_2: R15.2 T3.5(B)
NetR16_1: R16.1 R26.1 R29.2
NetR16_2: R16.2 T1.3(C)
NetR22_1: R22.1 R27.1 R30.2
NetR22_2: R22.2 T2.3(C)
NetR25_1: R25.1 R28.1 R31.2
NetR25_2: R25.2 T3.3(C)

Not connected (* = marked no-connect by the designer): IC1 3(NC)* 4(NC)*; IC2 9(QH')*; IC4 13(N/C)* 14(N/C)* 16(N/C)*

### Channels
CH1: designators end in A; ports LED=LED1 REG_LATCH=REG_LATCH1 REG_NOE=REG_NOE SER_CLK=SER_CLK SER_MOSI=SER_MOSI VCO_IN=VCO_IN1 VCO_OUT=VCO_OUT1
CH2: designators end in B; ports LED=LED2 REG_LATCH=REG_LATCH2 REG_NOE=REG_NOE SER_CLK=SER_CLK SER_MOSI=SER_MOSI VCO_IN=VCO_IN2 VCO_OUT=VCO_OUT2
CH3: designators end in C; ports LED=LED3 REG_LATCH=REG_LATCH3 REG_NOE=REG_NOE SER_CLK=SER_CLK SER_MOSI=SER_MOSI VCO_IN=VCO_IN3 VCO_OUT=VCO_OUT3
CH4: designators end in D; ports LED=LED4 REG_LATCH=REG_LATCH4 REG_NOE=REG_NOE SER_CLK=SER_CLK SER_MOSI=SER_MOSI VCO_IN=VCO_IN4 VCO_OUT=VCO_OUT4

### Layout directives
net class 50_Ohms: NetC24A_1, NetIC1A_2, NetIC1A_5, NetIC3A_7, NetIC4A_2, VCO_IN1

### Notes on the sheet
- Copyright WUT 2017
  This documentation describes Open Hardware and is licensed under the CERN OHL v.1.1. You may redistribute and modify this documentation under the terms of the CERN OHL v.1.1. (http://ohwr.org/CERNOHL). This documentation is distributed WITHOUT ANY EXPRESS OR IMPLIED WARRANTY, INCLUDING OF MERCHANTABILITY, SATISFACTORY QUALITY AND FITNESS FOR A PARTICULAR PURPOSE. Please see the CERN OHL v.1.1 for applicable conditions.
- Project/Equipment
- Document
- Designer
- Drawn by
- Check.by
- File
- Last Mod.
- Print Date
- Sheet
- Size
- A3
- of
- Rev
- (in symbol HMC424ALP3E) 0.5dB; 1dB; 2dB; 4dB; 8dB; 16dB
- (in symbol HMC1118LP3DE) 50
- (in symbol R0402_3K_1%_0.0625W_100PPM) 1%
- (in symbol R0402_5K1_1%_0.0625W_100PPM) 1%
- (in symbol R0402_10K_1%_0.0625W_100PPM) 1%
- (in symbol R0402_100R_1%_0.1W_100PPM) 1%
- (in symbol R0402_270K_1%_0.0625W_100PPM) 1%

### Library data of the parts
C12 = CC0402_18PF_50V_5%_C0G: Non-polarised capacitor; Part Description: SMD Multilayer Chip Ceramic Capacitor; Manufacturer: GENERIC; Manufacturer1 Part Number: C0402C180J5GACTU; Voltage: 50V; TC: C0G/NP0; Tolerance: ±5%; Part Number: CC0402_18PF_50V_5%_C0G; Component Kind: Standard; Component Type: Standard; Pin Count: 2; Value: 18pF; Status: Preferred; Manufacturer Part Number: CC0402_18PF_50V_5%_C0G; Case: 0402; Mounted: Yes; Socket: No; SMD: Yes; Sense: No; Manufacturer1 Example: KEMET; Manufacturer1 ComponentHeight: 0.55mm; HelpURL: \\cern.ch\dfs\Applications\Altium\Datasheets\CC0402_C0G_KEMET_(Commercial Grade).pdf; Author: CERN DEM JLC; CreateDate: 04.10.2016; LatestRevisionDate: 04.10.2016
C13 = CC0402_5.6PF_50V_0.1PF_NP0_JOHANSON_R07S: Non-polarised capacitor; Part Description: Ultra High-Q SMD Multilayer Capacitor; Manufacturer: JOHANSON TECHNOLOGY; Manufacturer Part Number: 500R07S5R6BV4T; Voltage: 50V; TC: C0G/NP0; Tolerance: ±0.1pF; Part Number: CC0402_5.6PF_50V_0.1PF_NP0_JOHANSON_R07S; Component Kind: Standard; Component Type: Standard; Pin Count: 2; Value: 5.6pF; Status: Not Recommended; Case: 0402; Mounted: Yes; Socket: No; SMD: Yes; Sense: No; ComponentHeight: 0.61mm; HelpURL: \\cern.ch\dfs\Applications\Altium\Datasheets\CC0402_NP0_JOHANSON_R07S.pdf; Author: CERN DEM MR; CreateDate: 20.09.2018; LatestRevisionDate: 26.09.2018
C15 = CC0402_1NF_50V_10%_X7R: Non-polarised capacitor; Part Description: SMD Multilayer Chip Ceramic Capacitor; Manufacturer: GENERIC; Manufacturer1 Part Number: 223858715623; Voltage: 50V; TC: X7R; Tolerance: ±10%; Part Number: CC0402_1NF_50V_10%_X7R; Component Kind: Standard; Component Type: Standard; Pin Count: 2; Value: 1nF; Status: Not Recommended; Manufacturer Part Number: CC0402_1NF_50V_10%_X7R; Case: 0402; Mounted: Yes; Socket: No; SMD: Yes; Sense: No; Manufacturer1 Example: PHYCOMP; Manufacturer1 ComponentHeight: 0.55mm; HelpURL: \\cern.ch\dfs\Applications\Altium\Datasheets\CC0402_X7R_PHYCOMP.pdf; Author: CERN DEM JLC; CreateDate: 03.12.2007; LatestRevisionDate: 03.12.2007
C16 = CC0402_100NF_16V_10%_X5R: as C53 on sheet Almazny_top; Part Number: CC0402_100NF_16V_10%_X5R; Component Kind: Standard; Component Type: Standard; Pin Count: 2; Value: 100nF; Status: None; Manufacturer Part Number: CC0402_100NF_16V_10%_X5R; Case: 0402; Mounted: Yes; Socket: No; SMD: Yes; Sense: No; Manufacturer1 Example: MURATA; Manufacturer1 ComponentHeight: 0.55mm; HelpURL: \\cern.ch\dfs\Applications\Altium\Datasheets\CC0402_X5R_MURATA_GRM.pdf; Author: CERN DEM JLC; CreateDate: 10.12.2013; LatestRevisionDate: 10.12.2013
C17 C19 = CC0603_4.7UF_16V_10%_X5R: Non-polarised capacitor; Manufacturer: GENERIC; Part Description: SMD Multilayer Chip Ceramic Capacitor; Manufacturer1 Part Number: EMK107ABJ475KA-T; Voltage: 16V; TC: X5R; Tolerance: ±10%; Value: 4.7uF; Manufacturer Part Number: CC0603_4.7UF_16V_10%_X5R; Part Number: CC0603_4.7UF_16V_10%_X5R; Component Kind: Standard; Component Type: Standard; Pin Count: 2; Status: None; Case: 0603; Mounted: Yes; Socket: No; SMD: Yes; Sense: No; Manufacturer1 Example: TAIYO YUDEN; Manufacturer1 ComponentHeight: 0.95mm; HelpURL: \\cern.ch\dfs\Applications\Altium\Datasheets\CC0603_X7R_TAIYO-YUDEN_HIGH-VALUE.pdf; Author: CERN DEM JLC; CreateDate: 16.12.2013; LatestRevisionDate: 16.09.2014
C18 C20 C29-C32 = CC0402_100NF_16V_10%_X5R: Non-polarised capacitor; Manufacturer: GENERIC; Part Description: SMD Multilayer Chip Ceramic Capacitor; Manufacturer1 Part Number: GRM155R61C104KA88D; Voltage: 16V; TC: X5R; Tolerance: ±10%; Value: 100nF; Manufacturer Part Number: CC0402_100NF_16V_10%_X5R; Part Number: CC0402_100NF_16V_10%_X5R; Component Kind: Standard; Component Type: Standard; Pin Count: 2; Status: None; Case: 0402; Mounted: Yes; Socket: No; SMD: Yes; Sense: No; Manufacturer1 Example: MURATA; Manufacturer1 ComponentHeight: 0.55mm; HelpURL: \\cern.ch\dfs\Applications\Altium\Datasheets\CC0402_X5R_MURATA_GRM.pdf; Author: CERN DEM JLC; CreateDate: 10.12.2013; LatestRevisionDate: 10.12.2013
C21 C25 C27 = CC0603_1UF_16V_10%_X7R: Non-polarised capacitor; Manufacturer: GENERIC; Part Description: SMD Multilayer Chip Ceramic Capacitor; Manufacturer1 Part Number: 223878615663; Voltage: 16V; TC: X7R; Tolerance: ±10%; Value: 1uF; Manufacturer Part Number: CC0603_1UF_16V_10%_X7R; Part Number: CC0603_1UF_16V_10%_X7R; Component Kind: Standard; Component Type: Standard; Pin Count: 2; Status: None; Case: 0603; Mounted: Yes; Socket: No; SMD: Yes; Sense: No; Manufacturer1 Example: YAGEO PHYCOMP; Manufacturer1 ComponentHeight: 0.9mm; HelpURL: \\cern.ch\dfs\Applications\Altium\Datasheets\CC0603_X7R_PHYCOMP.pdf; Author: CERN DEM JLC; CreateDate: 03.12.2007; LatestRevisionDate: 17.04.2015
C22 C26 C28 = CC0402_1NF_50V_10%_X7R: Non-polarised capacitor; Manufacturer: GENERIC; Part Description: SMD Multilayer Chip Ceramic Capacitor; Manufacturer1 Part Number: 223858715623; Voltage: 50V; TC: X7R; Tolerance: ±10%; Value: 1nF; Manufacturer Part Number: CC0402_1NF_50V_10%_X7R; Part Number: CC0402_1NF_50V_10%_X7R; Component Kind: Standard; Component Type: Standard; Pin Count: 2; Status: Not Recommended; Case: 0402; Mounted: Yes; Socket: No; SMD: Yes; Sense: No; Manufacturer1 Example: PHYCOMP; Manufacturer1 ComponentHeight: 0.55mm; HelpURL: \\cern.ch\dfs\Applications\Altium\Datasheets\CC0402_X7R_PHYCOMP.pdf; Author: CERN DEM JLC; CreateDate: 03.12.2007; LatestRevisionDate: 03.12.2007
C23 = CC0805_22UF_16V_10%_X5R: Non-polarised capacitor; Part Description: SMD Multilayer Chip Ceramic Capacitor; Manufacturer: GENERIC; Manufacturer1 Part Number: C2012X5R1C226KT; Voltage: 16V; TC: X5R; Tolerance: ±10%; Part Number: CC0805_22UF_16V_10%_X5R; Component Kind: Standard; Component Type: Standard; Pin Count: 2; Value: 22uF; Status: Preferred; Manufacturer Part Number: CC0805_22UF_16V_10%_X5R; Case: 0805; Mounted: Yes; Socket: No; SMD: Yes; Sense: No; Manufacturer1 Example: TDK; Manufacturer1 ComponentHeight: 1.35mm; HelpURL: \\cern.ch\dfs\Applications\Altium\Datasheets\CC0805_X5R_TDK_C.pdf; Author: CERN DEM JLC; CreateDate: 25.10.2012; LatestRevisionDate: 25.10.2012
C24 = CC0402_100NF_16V_10%_X7R_ATC_ATC530L: Non-polarised capacitor; Part Description: Broadband SMD Multilayer Chip Ceramic Capacitor; Manufacturer: ATC; Manufacturer Part Number: ATC530L104KT16T; Voltage: 16V; Tolerance: ±10%; TC: X7R; Part Number: CC0402_100NF_16V_10%_X7R_ATC_ATC530L; Component Kind: Standard; Component Type: Standard; Pin Count: 2; Value: 100nF; Status: Not Recommended; Case: 0402; Mounted: Yes; Socket: No; SMD: Yes; Sense: No; ComponentHeight: 0.61mm; HelpURL: \\cern.ch\dfs\Applications\Altium\Datasheets\CC0402_X7R_ATC_ATC530L104KT16.pdf; Author: CERN DEM BC; CreateDate: 17.11.2017; LatestRevisionDate: 21.11.2017
IC1 = AVA-183A+: 5-18GHz, 50 Ohm Monolithic Amplifier; Part Description: 5 to 18GHz, 50 Ohm, Monolithic Amplifier; Manufacturer: MINI-CIRCUITS; PressFit: No; Bonding: No; Part Number: AVA-183A+; Component Kind: Standard; Component Type: Standard; Device: AVA-183A+; PackageDescription: MINI-CIRCUITS DQ849 Case, 0.66mm pitch, 8 pin, 3mm X 3mm X 0.99mm H body (w/thermal tab 1.7 X 1.7mm); Manufacturer Part Number: AVA-183A+; Pin Count: 8; Mounted: Yes; Socket: No; SMD: Yes; Sense: No; ComponentHeight: 0.99mm; Author: CERN DEM JLC; HelpURL: \\cern.ch\dfs\Applications\Altium\Datasheets\AVA-183A+.pdf; CreateDate: 20.04.2015; LatestRevisionDate: 20.04.2015
IC2 = SN74HC595D: 8-Bit Shift Register With 3-State Output Register; Part Description: 8-Bit Shift Register With 3-State Output Registers; Manufacturer: TEXAS INSTRUMENTS; PressFit: No; Bonding: No; Part Number: SN74HC595D; Component Kind: Standard; Component Type: Standard; Device: SN74HC595D; PackageDescription: SOIC 16, Pitch 1.27mm - Body 4x10mm, IPC Medium Density; Manufacturer Part Number: SN74HC595D; Pin Count: 16; Case: SOIC16; Mounted: Yes; Socket: No; SMD: Yes; Sense: No; ComponentHeight: 1.75mm; Author: CERN DEM JLC; HelpURL: \\cern.ch\dfs\Applications\Altium\Datasheets\SN74HC595D.pdf; CreateDate: 05.06.2012; LatestRevisionDate: 05.06.2012
IC3 = HMC1118LP3DE: High Isolation, Silicon SPDT, Non-Reflective Switch, 9 kHz to 13.0 GHz; Manufacturer: ANALOG DEVICES; PressFit: No; Bonding: No; Part Number: HMC1118LP3DE; Component Kind: Standard; Component Type: Standard; Device: HMC1118LP3DE; PackageDescription: QFN, 0.50mm Pitch, Square; 16 Pin, 3.00mm L X 3.00mm W X 0.95mm H Body (w/Thermal Tab 1.90 X 1.90mm),  IPC Medium Density; Part Description: High Isolation, Silicon SPDT, Non-Reflective Switch, 9 kHz to 13.0 GHz; Manufacturer Part Number: HMC1118LP3DE; Pin Count: 17; Case: QFN16; Mounted: Yes; Socket: No; SMD: Yes; Sense: No; ComponentHeight: 0.95mm; Author: CERN DEM MR; HelpURL: \\cern.ch\dfs\Applications\Altium\Datasheets\HMC1118LP3DE.pdf; CreateDate: 17.04.2019; LatestRevisionDate: 17.04.2019
IC4 = HMC424ALP3E: 0.5 dB LSB GaAs MMIC 6-BIT Digital Attenuator, DC - 13 GHz; Manufacturer: ANALOG DEVICES; PressFit: No; Bonding: No; Part Number: HMC424ALP3E; Component Kind: Standard; Component Type: Standard; Device: HMC424ALP3E; PackageDescription: QFN, 0.50mm Pitch, Square; 16 Pin, 3.00mm L X 3.00mm W X 1.00mm H Body (w/Thermal Tab 1.95 X 1.95mm), IPC Medium Density; Part Description: 0.5dB LSB GaAs MMIC 6-BIT Digital Attenuator, DC - 13 GHz; Manufacturer Part Number: HMC424ALP3E; Pin Count: 17; Case: QFN16; Mounted: Yes; Socket: No; SMD: Yes; Sense: No; ComponentHeight: 1mm; Author: CERN DEM BC; HelpURL: \\cern.ch\dfs\Applications\Altium\Datasheets\HMC424ALP3E.pdf; CreateDate: 17.09.2020; LatestRevisionDate: 17.09.2020
IC5 = YAT-3+: DC to 18GHz, 2W, 50 Ohm, 0dB Attenuator; Part Description: DC to 18GHz,  2W, 50 Ohms, 0dB Attenuator; Manufacturer: MINI-CIRCUITS; PressFit: No; Bonding: No; Part Number: YAT-0+; Component Kind: Standard; Component Type: Standard; Device: YAT-0+; PackageDescription: MINI-CIRCUITS MC1630 Case, 0.65mm Pitch, 6 Pin, 2.00mm X 2.00mm X 0.85mm H body (w/Thermal Tab 0.65 X 1.25mm); Manufacturer Part Number: YAT-0+; Pin Count: 7; Mounted: Yes; Socket: No; SMD: Yes; Sense: No; ComponentHeight: 0.85mm; Author: CERN DEM JLC; HelpURL: \\cern.ch\dfs\Applications\Altium\Datasheets\YAT-3+.pdf; CreateDate: 20.04.2015; LatestRevisionDate: 20.04.2015
IC6 = YAT-30+: DC to 18GHz, 2W, 50 Ohm, 4dB Attenuator; Part Description: DC to 18GHz,  1.3W, 50 Ohms, 30dB Attenuator; Manufacturer: MINI-CIRCUITS; PressFit: No; Bonding: No; Part Number: YAT-30+; Component Kind: Standard; Component Type: Standard; Device: YAT-30+; PackageDescription: MINI-CIRCUITS MC1630 Case, 0.65mm Pitch, 6 Pin, 2.00mm X 2.00mm X 0.85mm H body (w/Thermal Tab 0.65 X 1.25mm); Manufacturer Part Number: YAT-30+; Pin Count: 7; Mounted: Yes; Socket: No; SMD: Yes; Sense: No; ComponentHeight: 0.85mm; Author: CERN DEM MR; HelpURL: \\cern.ch\dfs\Applications\Altium\Datasheets\YAT-30+.pdf; CreateDate: 04.10.2017; LatestRevisionDate: 04.10.2017
L1 = IND0805_6.8NH_10%_EPCOS_B82498B: Inductor With Core; Part Description: SMT Inductor SIMID Series; Manufacturer: EPCOS; Manufacturer Part Number: B82498B3689K; Power: 800mA; Resistance: 0.06R; Tolerance: ±10%; Part Number: IND0805_6.8NH_10%_EPCOS_B82498B; Component Kind: Standard; Component Type: Standard; Pin Count: 2; Value: 6.8nH; Status: Preferred; Case: 0805; Mounted: Yes; Socket: No; SMD: Yes; Sense: No; ComponentHeight: 1.45mm; HelpURL: \\cern.ch\dfs\Applications\Altium\Datasheets\IND0805_EPCOS_B82498B.pdf; Author: CERN DEM JLC; CreateDate: 11.02.2008; LatestRevisionDate: 26.06.2008
L2-L5 L10 = IND0603_MURATA_BLM18HE102SN1: Manufacturer: MURATA; Part Description: SMD EMIFIL Suppression Chip Ferrite Bead; Power: 600mA; Resistance: 0.35R; Tolerance: ±25%; Value: 1000R@100MHz; Manufacturer Part Number: BLM18HE102SN1; Part Number: IND0603_MURATA_BLM18HE102SN1; Component Kind: Standard; Component Type: Standard; Pin Count: 2; Status: None; Case: 0603; Mounted: Yes; Socket: No; SMD: Yes; Sense: No; ComponentHeight: 0.95mm; HelpURL: \\cern.ch\dfs\Applications\Altium\Datasheets\IND0603_MURATA_BLM18H.pdf; Author: CERN DEM JLC; CreateDate: 09.12.2013; LatestRevisionDate: 25.10.2018
R1-R3 R13-R15 = R0402_270K_1%_0.0625W_100PPM: Resistor - 1%; Part Description: General Purpose Thick Film Chip Resistor; Manufacturer: GENERIC; Manufacturer1 Part Number: 232270672704L; TC: ±100ppm/°C; PressFit: No; Part Number: R0402_270K_1%_0.0625W_100PPM; Component Kind: Standard; Component Type: Standard; Pin Count: 2; Value: 270k; Status: Not Recommended; Power: 0.0625W; Tolerance: ±1%; Manufacturer Part Number: R0402_270K_1%_0.0625W_100PPM; Case: 0402; Mounted: Yes; Sense: No; Socket: No; SMD: Yes; Manufacturer1 Example: YAGEO PHYCOMP; Manufacturer1 ComponentHeight: 0.4mm; HelpURL: \\cern.ch\dfs\Applications\Altium\Datasheets\R0402_Phycomp_RC0402.pdf; Author: CERN DEM JLC; CreateDate: 03.12.2007; LatestRevisionDate: 17.10.2012
R4-R6 R16 R22 R25 = R0402_3K_1%_0.0625W_100PPM: Resistor - 1%; Part Description: General Purpose Thick Film Chip Resistor; Manufacturer: GENERIC; Manufacturer1 Part Number: 232270673002L; TC: ±100ppm/°C; PressFit: No; Part Number: R0402_3K_1%_0.0625W_100PPM; Component Kind: Standard; Component Type: Standard; Pin Count: 2; Value: 3k; Status: Not Recommended; Power: 0.0625W; Tolerance: ±1%; Manufacturer Part Number: R0402_3K_1%_0.0625W_100PPM; Case: 0402; Mounted: Yes; Sense: No; Socket: No; SMD: Yes; Manufacturer1 Example: YAGEO PHYCOMP; Manufacturer1 ComponentHeight: 0.4mm; HelpURL: \\cern.ch\dfs\Applications\Altium\Datasheets\R0402_Phycomp_RC0402.pdf; Author: CERN DEM JLC; CreateDate: 03.12.2007; LatestRevisionDate: 17.10.2012
R7-R9 R17-R21 R23 R24 R26-R28 = R0402_100R_1%_0.1W_100PPM: Resistor - 1%; Part Description: General Purpose Thick Film Chip Resistor; Manufacturer: GENERIC; Manufacturer Part Number: R0402_100R_1%_0.1W_100PPM_50V; Manufacturer1 Part Number: ERJ2RKF1000X; Power: 0.1W; TC: ±100ppm/°C; PressFit: No; Voltage: 50V; Part Number: R0402_100R_1%_0.1W_100PPM; Component Kind: Standard; Component Type: Standard; Pin Count: 2; Value: 100; Status: Not Recommended; Tolerance: ±1%; Case: 0402; Mounted: Yes; Sense: No; Socket: No; SMD: Yes; Manufacturer1 Example: PANASONIC; Manufacturer1 ComponentHeight: 0.4mm; HelpURL: \\cern.ch\dfs\Applications\Altium\Datasheets\R0402_PANASONIC_ERJ2RK.pdf; Author: CERN DEM JLC; CreateDate: 12.12.2013; LatestRevisionDate: 03.03.2015
R10-R12 R29-R31 = R0402_5K1_1%_0.0625W_100PPM: Resistor - 1%; Part Description: General Purpose Thick Film Chip Resistor; Manufacturer: GENERIC; Manufacturer1 Part Number: 232270675102L; TC: ±100ppm/°C; PressFit: No; Part Number: R0402_5K1_1%_0.0625W_100PPM; Component Kind: Standard; Component Type: Standard; Pin Count: 2; Value: 5k1; Status: Not Recommended; Power: 0.0625W; Tolerance: ±1%; Manufacturer Part Number: R0402_5K1_1%_0.0625W_100PPM; Case: 0402; Mounted: Yes; Sense: No; Socket: No; SMD: Yes; Manufacturer1 Example: YAGEO PHYCOMP; Manufacturer1 ComponentHeight: 0.4mm; HelpURL: \\cern.ch\dfs\Applications\Altium\Datasheets\R0402_Phycomp_RC0402.pdf; Author: CERN DEM JLC; CreateDate: 03.12.2007; LatestRevisionDate: 17.10.2012
R41-R46 R58 = R0402_10K_1%_0.0625W_100PPM: as R40 on sheet Almazny_top; Part Number: R0402_10K_1%_0.0625W_100PPM; Component Kind: Standard; Component Type: Standard; Pin Count: 2; Value: 10k; Status: Not Recommended; Power: 0.0625W; Tolerance: ±1%; Manufacturer Part Number: R0402_10K_1%_0.0625W_100PPM; Case: 0402; Mounted: Yes; Sense: No; Socket: No; SMD: Yes; Manufacturer1 Example: YAGEO PHYCOMP; Manufacturer1 ComponentHeight: 0.4mm; HelpURL: \\cern.ch\dfs\Applications\Altium\Datasheets\R0402_Phycomp_RC0402.pdf; Author: CERN DEM JLC; CreateDate: 03.12.2007; LatestRevisionDate: 17.10.2012
T1-T3 = BC857BV: 45V, 100mA PNP General Purpose Double Transistor; Part Description: -45V -100mA PNP General Purpose Double Transistor; Manufacturer: NXP SEMICONDUCTORS; PressFit: No; Bonding: No; Part Number: BC857BV; Component Kind: Standard; Component Type: Standard; Device: BC857BV; PackageDescription: SOTFL (SOT666), 0.50mm, Pitch; 6 Pin, 1.20mm W X 1.60mm L X 0.60mm H Body, IPC Medium Density; Manufacturer Part Number: BC857BV; Pin Count: 6; Case: SOT666; Mounted: Yes; Socket: No; SMD: Yes; Sense: No; ComponentHeight: 0.6mm; HelpURL: \\cern.ch\dfs\Applications\Altium\Datasheets\BC857BV.pdf; Author: CERN DEM JLC; CreateDate: 01.12.2011; LatestRevisionDate: 01.12.2011